# EAGLE design bandpass 40m v3 (EAGLE 9.1.2)
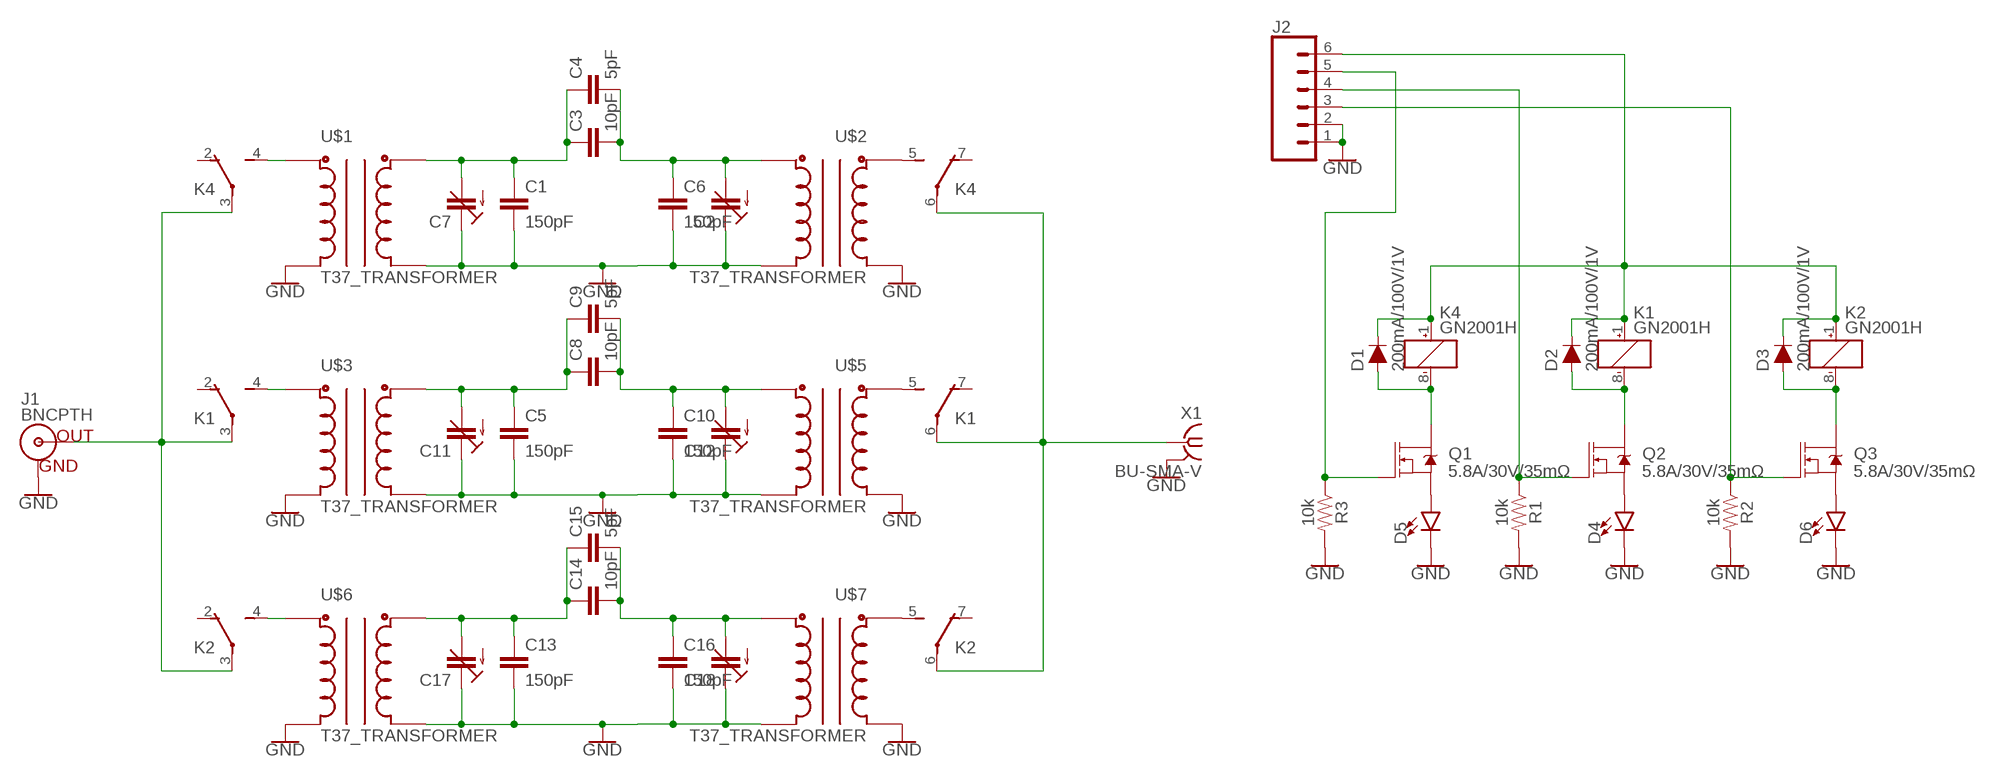
[diagram p0: schematic, sheet 1]

## Parts
C1  150pF  C5/3.5  [C5B3.5]
C2  C-TRIMMTZ03  [CTRIMTZ03]
C3  10pF  C5/3.5  [C5B3.5]
C4  5pF  C5/3.5  [C5B3.5]
C5  150pF  C5/3.5  [C5B3.5]
C6  150pF  C5/3.5  [C5B3.5]
C7  C-TRIMMTZ03  [CTRIMTZ03]
C8  10pF  C5/3.5  [C5B3.5]
C9  5pF  C5/3.5  [C5B3.5]
C10  150pF  C5/3.5  [C5B3.5]
C11  C-TRIMMTZ03  [CTRIMTZ03]
C12  C-TRIMMTZ03  [CTRIMTZ03]
C13  150pF  C5/3.5  [C5B3.5]
C14  10pF  C5/3.5  [C5B3.5]
C15  5pF  C5/3.5  [C5B3.5]
C16  150pF  C5/3.5  [C5B3.5]
C17  C-TRIMMTZ03  [CTRIMTZ03]
C18  C-TRIMMTZ03  [CTRIMTZ03]
D1  200mA/100V/1V  DIODE-1N4148  [DIODE-1N4148]
D2  200mA/100V/1V  DIODE-1N4148  [DIODE-1N4148]
D3  200mA/100V/1V  DIODE-1N4148  [DIODE-1N4148]
D4  LED5MM  [LED_5MM]
D5  LED5MM  [LED_5MM]
D6  LED5MM  [LED_5MM]
J1  BNCPTH  [BNC]
J2  CONN_06LONGPADS  [1X06_LONGPADS]
K1  GN2001H  [GN]
K2  GN2001H  [GN]
K4  GN2001H  [GN]
Q1  5.8A/30V/35mΩ  MOSFET-NCH-AO3404A  [SOT23-3]
Q2  5.8A/30V/35mΩ  MOSFET-NCH-AO3404A  [SOT23-3]
Q3  5.8A/30V/35mΩ  MOSFET-NCH-AO3404A  [SOT23-3]
R1  10k  1KOHM-HORIZ-1/4W-1%  [AXIAL-0.3]
R2  10k  1KOHM-HORIZ-1/4W-1%  [AXIAL-0.3]
R3  10k  1KOHM-HORIZ-1/4W-1%  [AXIAL-0.3]
U$1  T37_TRANSFORMER  [T37_TRANSFORMER]
U$2  T37_TRANSFORMER  [T37_TRANSFORMER]
U$3  T37_TRANSFORMER  [T37_TRANSFORMER]
U$5  T37_TRANSFORMER  [T37_TRANSFORMER]
U$6  T37_TRANSFORMER  [T37_TRANSFORMER]
U$7  T37_TRANSFORMER  [T37_TRANSFORMER]
X1  BU-SMA-V  [BU-SMA-V]

## Nets
GND: C1.2 C2.1(E) C5.2 C6.2 C7.1(E) C10.2 C11.1(E) C12.1(E) C13.2 C16.2 C17.1(E) C18.1(E) D4.K(C) D5.K(C) D6.K(C) J1.GND J2.1 J2.2 R1.P$2 R2.P$2 R3.P$2 U$1.C1A U$1.C2A U$2.C1A U$2.C2A U$3.C1A U$3.C2A U$5.C1A U$5.C2A U$6.C1A U$6.C2A U$7.C1A U$7.C2A X1.2 X1.3 X1.4 X1.5
N$1: C1.1 C3.1 C4.1 C7.2(A) U$1.C2B
N$2: K4.4(S:S) U$1.C1B
N$3: C2.2(A) C3.2 C4.2 C6.1 U$2.C2B
N$4: K1.6(T:P) K2.6(T:P) K4.6(T:P) X1.1
N$5: K4.5(T:S) U$2.C1B
N$6: C5.1 C8.1 C9.1 C11.2(A) U$3.C2B
N$7: C8.2 C9.2 C10.1 C12.2(A) U$5.C2B
N$8: K1.4(S:S) U$3.C1B
N$9: K1.5(T:S) U$5.C1B
N$10: C13.1 C14.1 C15.1 C17.2(A) U$6.C2B
N$11: C14.2 C15.2 C16.1 C18.2(A) U$7.C2B
N$12: J1.S(OUT) K1.3(S:P) K2.3(S:P) K4.3(S:P)
N$13: K2.5(T:S) U$7.C1B
N$14: K2.4(S:S) U$6.C1B
N$15: D1.A K4.8(R:-) Q1.3(D)
N$16: D2.A K1.8(R:-) Q2.3(D)
N$17: D3.A K2.8(R:-) Q3.3(D)
N$18: D4.A Q2.2(S)
N$19: J2.5 Q1.1(G) R3.P$1
N$20: J2.4 Q2.1(G) R1.P$1
N$21: J2.3 Q3.1(G) R2.P$1
N$22: D1.C D2.C D3.C J2.6 K1.1(R:+) K2.1(R:+) K4.1(R:+)
N$23: D5.A Q1.2(S)
N$24: D6.A Q3.2(S)
Unconnected: K1.2(S:O) K1.7(T:O) K2.2(S:O) K2.7(T:O) K4.2(S:O) K4.7(T:O)

## Library data of the parts
C1 C3-C6 C8-C10 C13-C16 = capacitor-wima:C: CAPACITOR naming: grid - package width
C2 C7 C11 C12 C17 C18 = resistor:C-TRIMM: Trimm capacitor
D1-D3 = SparkFun-DiscreteSemi:DIODE: Diode These are standard reverse protection diodes and small signal diodes. SparkFun Products: SparkFun SparkPunk Sound Kit <https://www.sparkfun.com/products/11177> SparkFun ESP8266 Thing <https://www.sparkfun.com/products/13231>; PROD_ID: DIO-08378
D4-D6 = SparkFun-LED:LED: LED (Generic) Standard schematic elements and footprints for 5mm, 3mm, 1206, and 0603 sized LEDs. Generic LEDs with no color specified.
J1 = SparkFun-Connectors:BNC: BNC Right Angle Connector Mouser Part# 5227161 SparkFun Products: BNC Connector - Right Angle <https://www.sparkfun.com/products/10550>; PROD_ID: LPA-12729; SF_ID: PRT-10550
J2 = SparkFun-Connectors:CONN_06: Multi connection point. Often used as Generic Header-pin footprint for 0.1 inch spaced/style header connections On any of the 0.1 inch spaced packages, you can populate with these: Break Away Headers - Straight <https://www.sparkfun.com/products/116> (PRT-00116) Break Away Male Headers - Right Angle <https://www.sparkfun.com/products/553> (PRT-00553) Female Headers <https://www.sparkfun.com/products/115> (PRT-00115) Break Away Headers - Machine Pin <https://www.sparkfun.com/products/117> (PRT-00117) Break Away Female Headers - Swiss Machine Pin <https://www.sparkfun.com/products/743> (PRT-00743) Arduino Stackable Header - 6 Pin <https://www.sparkfun.com/products/9280> (PRT-09280) For SCREWTERMINALS and SPRING TERMINALS visit here: Screw Terimnals on SparkFun.com <https://www.sparkfun.com/search/results?term=Screw+Terminals> (5mm/3.5mm/2.54mm spacing) This device is also useful as a general connection point to wire up your design to another part of your project. Our various solder wires solder well into these plated through hole pads. Hook-Up Wire - Assortment (Stranded, 22 AWG) <https://www.sparkfun.com/products/11375> (PRT-11375) Hook-Up Wire - Assortment (Solid Core, 22 AWG) <https://www.sparkfun.com/products/11367> (PRT-11367) View the entire wire category on our website here <https://www.sparkfun.com/categories/141>
K1 K2 K4 = relay:GN?*: ULTRA-SMALL PACKAGE SLIM POLARIZED RELAY NAiS Source: http://www.mew-europe.com/.. en_ds_61007_0000.pdf
Q1-Q3 = SparkFun-DiscreteSemi:MOSFET-NCH: N-channel MOSFETs Voltage controlled devices that allow control of high current outputs. SparkFun Products: SparkFun OpenScale <https://www.sparkfun.com/products/13261> SparkFun Digital Sandbox <https://www.sparkfun.com/products/12651> SparkFun Monster Moto Shield <https://www.sparkfun.com/products/10182> SparkFun MOSFET Power Controller <https://www.sparkfun.com/products/11214>; PROD_ID: TRANS-12988
R1-R3 = SparkFun-Resistors:1KOHM: 1kΩ resistor A resistor is a passive two-terminal electrical component that implements electrical resistance as a circuit element. Resistors act to reduce current flow, and, at the same time, act to lower voltage levels within circuits. - Wikipedia; PROD_ID: RES-12182; VALUE: 1k
U$1-U$3 U$5-U$7 = toroid:T37_TRANSFORMER: Transformer wound on a T37 Toroid
X1 = con-coax:BU-SMA-V: FEMALE SMA CONNECTOR Radiall distributor RS 112-3794; OC_FARNELL: unknown; OC_NEWARK: unknown

## Net classes
0 default: width 0.762 mm, drill 0.762 mm, clearance 0.508 mm

## Board
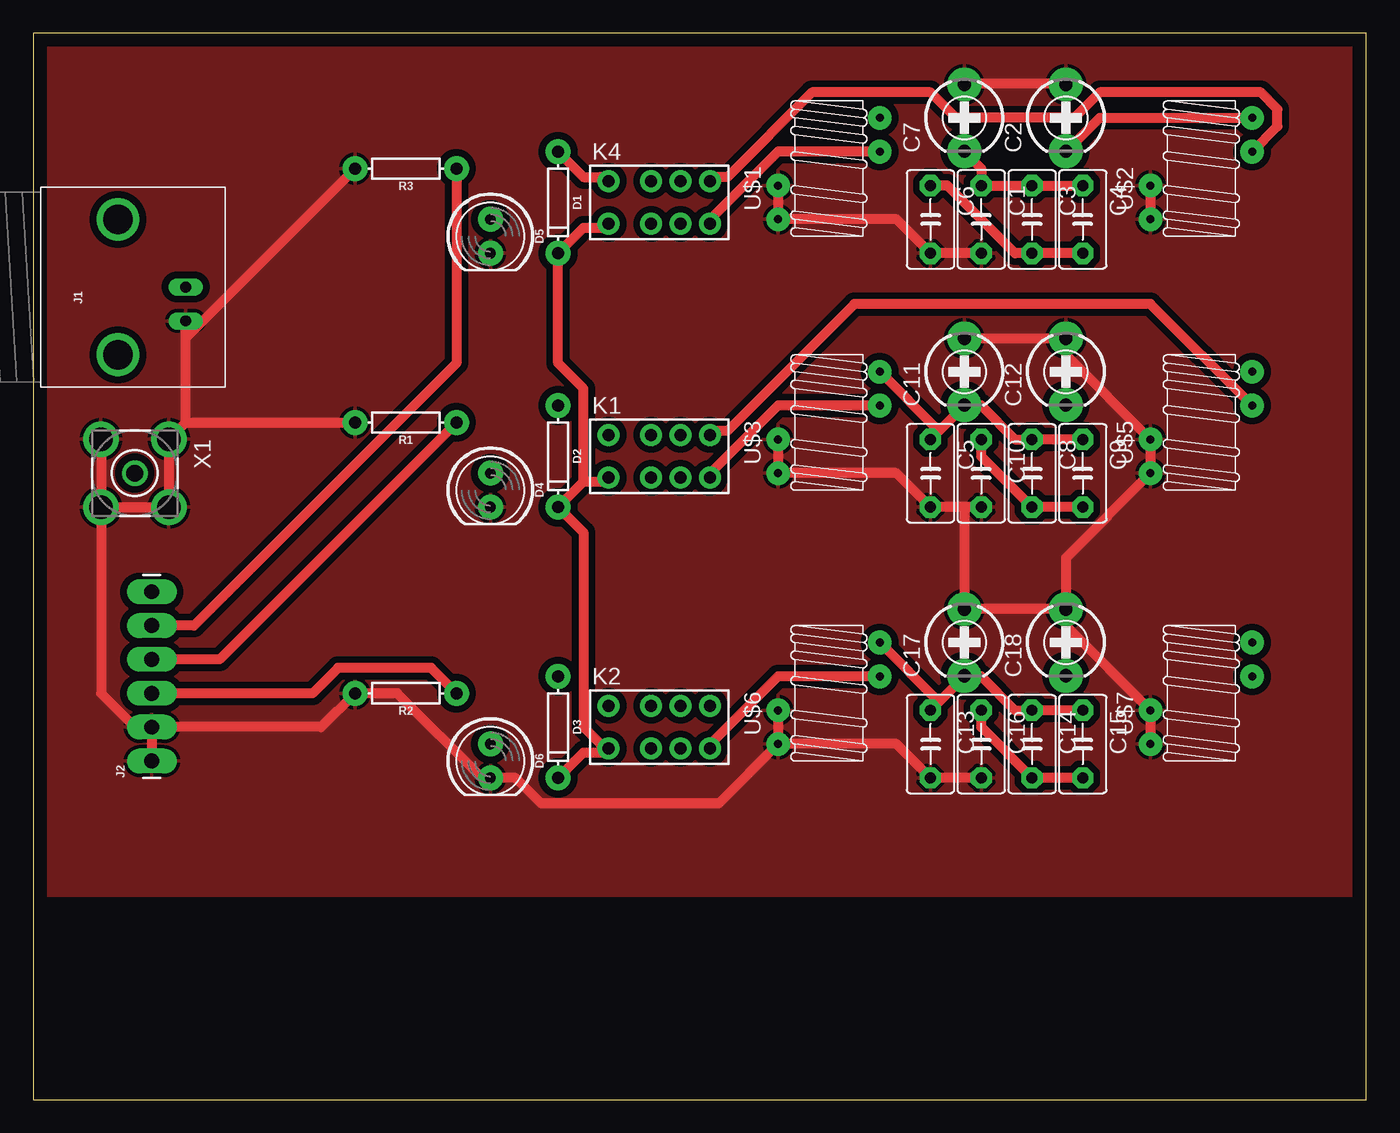
[diagram p1: board, top side]
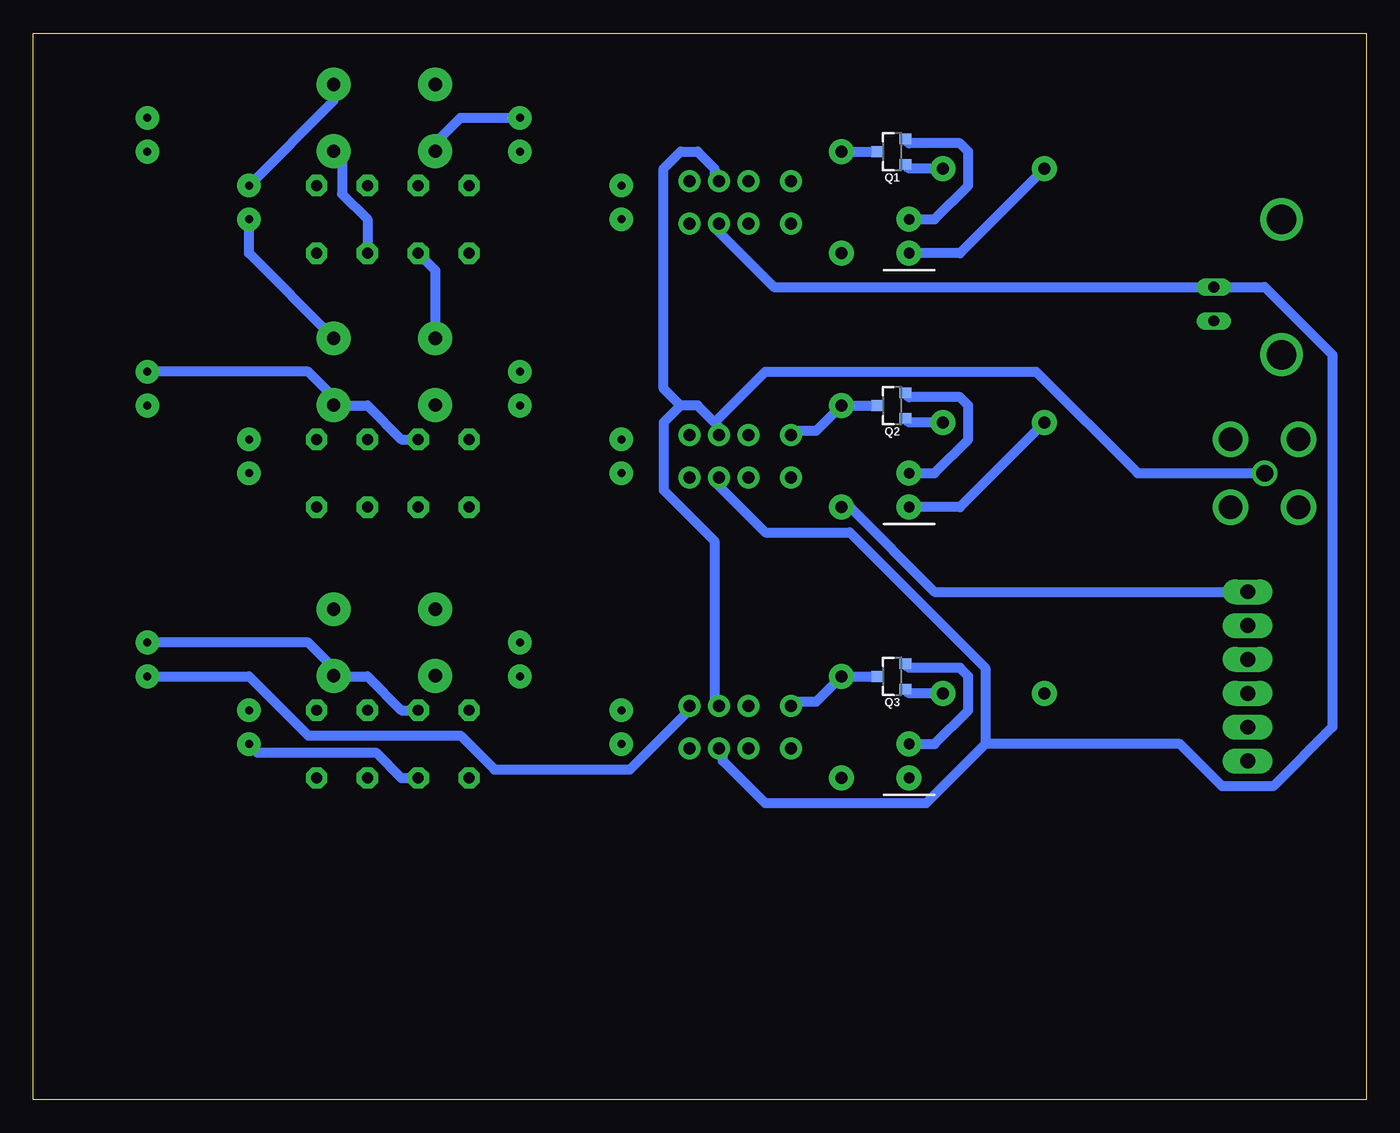
[diagram p2: board, bottom side, seen from below]

Size 100 x 80 mm. Coordinates in mm from the lower left corner, seen from the top.
Outline: 0,0 100,0 100,80 0,80 0,0
Copper layers (1*16): Top 0.035mm / dielectric 1.5mm / Bottom 0.035mm
Design rules "default": minimum track width 6mil, minimum drill 0.35mm, track to track 6mil, track to pad 6mil, pad to pad 6mil, via to via 6mil, smd to smd 6mil, copper to edge 40mil, drill to drill 6mil, minimum pad ring 10mil, minimum via ring 8mil, stop-mask expansion 4mil, vias tented up to drill 0mil, thermal gap 10mil

### Footprints (pad centres in the part's own frame; a part is rotated, then mirrored left to right if it is on the bottom)
C5B3.5 = drill 0.813 pad 1.6 octagon: 1 -2.54,0; 2 2.54,0
CTRIMTZ03 = drill 1 pad 2.54: 1 0,2.5; 2 0,-2.5
DIODE-1N4148 = drill 0.9 pad 1.88: A -3.81,0; C 3.81,0
LED_5MM = drill 0.813 pad 1.88: A -1.27,0; K 1.27,0
BNC = drill 2.2: 3 -5.08,5.08; 4 5.08,5.08 | drill 0.8 long: GND -2.54,0; S 0,0
1X06_LONGPADS = drill 1.118 pad 1.88 long: 1 0,0; 2 2.54,0; 3 5.08,0; 4 7.62,0; 5 10.16,0; 6 12.7,0
GN = drill 0.9 pad 1.651: 1 -3.835,-1.6; 2 -0.635,-1.6; 3 1.565,-1.6; 4 3.765,-1.6; 5 3.765,1.6; 6 1.565,1.6; 7 -0.635,1.6; 8 -3.835,1.6
SOT23-3 = smd 0.8 x 0.9: 1 -0.95,-1; 2 0.95,-1; 3 0,1.1
AXIAL-0.3 = drill 0.9 pad 1.88: P$1 -3.81,0; P$2 3.81,0
T37_TRANSFORMER = drill 0.6 pad 1.778: C1A -3.81,-3.81; C1B 3.81,1.27; C2A -3.81,-1.27; C2B 3.81,3.81
BU-SMA-V = drill 1.27: 1 0,0 | drill 1.778: 2 -2.55,2.55; 3 2.55,2.55; 4 2.55,-2.55; 5 -2.55,-2.55

### Placement (x,y rotation side)
C1  71.12,66.04 270 top
C2  77.47,73.66 0 top
C3  74.93,66.04 270 top
C4  78.74,66.04 270 top
C5  67.31,46.99 270 top
C6  67.31,66.04 270 top
C7  69.85,73.66 0 top
C8  74.93,46.99 270 top
C9  78.74,46.99 270 top
C10  71.12,46.99 270 top
C11  69.85,54.61 0 top
C12  77.47,54.61 0 top
C13  67.31,26.67 270 top
C14  74.93,26.67 270 top
C15  78.74,26.67 270 top
C16  71.12,26.67 270 top
C17  69.85,34.29 0 top
C18  77.47,34.29 0 top
D1  39.37,67.31 270 top
D2  39.37,48.26 270 top
D3  39.37,27.94 270 top
D4  34.29,45.72 270 top
D5  34.29,64.77 270 top
D6  34.29,25.4 270 top
J1  11.43,60.96 90 top
J2  8.89,25.4 90 top
K1  46.99,48.26 0 top
K2  46.99,27.94 0 top
K4  46.99,67.31 0 top
Q1  35.56,71.12 90 bottom
Q2  35.56,52.07 90 bottom
Q3  35.56,31.75 90 bottom
R1  27.94,50.8 180 top
R2  27.94,30.48 180 top
R3  27.94,69.85 180 top
U$1  59.69,69.85 0 top
U$2  87.63,69.85 0 top
U$3  59.69,50.8 0 top
U$5  87.63,50.8 0 top
U$6  59.69,30.48 0 top
U$7  87.63,30.48 0 top
X1  7.62,46.99 270 top

### Tracks (layer width: path | path; a pad name or v marks a point on that pad's centre or on a via)
GND
  Top 0.762: J2.2 J2.1 | J2.2 21.59,27.94 R2.P$2 27.3,30.48 33.66,24.13 D6.K 36.2,24.13 38.1,22.23 51.44,22.23 U$6.C1A | X1.4 X1.5 | X1.4 X1.3 | X1.4 5.08,43.81 5.08,30.48 7.62,27.94 J2.2 | 11.43,50.8 11.43,57.15 | 11.43,57.15 J1.GND | 11.43,50.8 X1.2 X1.3 | 11.43,50.8 R1.P$2 | X1.3 | 11.43,57.15 R3.P$2 | U$6.C2A U$6.C1A | C16.2 C13.2 64.77,26.67 U$6.C1A | U$7.C1A U$7.C2A 77.47,35.56 C18.1 77.47,36.83 | U$3.C2A U$3.C1A 64.77,46.99 C5.2 69.85,44.45 | C10.2 69.85,44.45 | 69.85,44.45 69.85,36.83 | 69.85,36.83 77.47,36.83 | 69.85,36.83 C17.1 | U$2.C2A U$2.C1A | C7.1 69.85,76.2 77.47,76.2 C2.1 | U$1.C2A U$1.C1A 64.77,66.04 C6.2 C1.2 | C11.1 69.85,57.15 77.47,57.15 C12.1 77.47,55.88 U$5.C2A U$5.C1A 77.47,40.64 77.47,36.83
  Bottom 0.762: D5.K 30.48,63.5 R3.P$2 | D4.K 30.48,44.45 R1.P$2 | C16.2 72.39,24.13 74.3,26.04 83.19,26.04 U$7.C1A | U$2.C2A 77.47,74.93 C2.1 | C11.1 69.85,62.23 C1.2 | U$2.C1A 83.82,63.5 77.47,57.15 C12.1
  pour Top: 0,80.01 100.33,80.01 100.33,15.24 0,15.24
N$1
  Top 0.762: C7.2 69.85,71.12 71.12,69.85 C1.1 C3.1 C4.1
  Bottom 0.762: U$1.C2B 67.94,73.66 69.85,71.75 C7.2
N$2
  Top 0.762: U$1.C1B 55.88,71.12 50.8,66.04 K4.4
N$3
  Top 0.762: C4.2 C3.2 73.66,63.5 68.58,68.58 C6.1 | U$2.C2B 80.01,73.66 77.47,71.12 C2.2
  Bottom 0.762: C3.2 74.93,66.04 76.83,67.94 76.83,70.48 77.47,71.12 C2.2
N$4
  Bottom 0.762: 51.44,52.07 52.7,50.8 52.7,45.72 48.9,41.91 48.9,29.84 K2.6 | 51.44,52.07 50.16,52.07 48.9,50.8 | 48.9,50.8 48.26,50.16 K1.6 | 51.44,52.07 52.7,53.34 52.7,69.85 51.44,71.12 50.16,71.12 48.9,69.85 48.9,69.22 K4.6 | X1.1 17.14,46.99 24.77,54.61 45.09,54.61 48.9,50.8
N$5
  Top 0.762: U$2.C1B 93.34,73.03 93.34,74.3 92.08,75.56 80.01,75.56 78.11,73.66 69.22,73.66 67.31,75.56 58.42,75.56 52.07,69.22 50.8,69.22 K4.5
N$6
  Top 0.762: C9.1 C8.1 73.66,49.53 71.12,52.07 69.85,52.07 | 69.85,52.07 67.94,50.16 | 67.94,50.16 C5.1 | 67.94,50.16 U$3.C2B | 69.85,52.07 C11.2
N$7
  Top 0.762: C9.2 C8.2 71.12,48.26 C10.1
  Bottom 0.762: U$5.C2B 79.38,54.61 77.47,52.7 C12.2 77.47,52.07 74.93,52.07 72.39,49.53 C10.1
N$8
  Top 0.762: U$3.C1B 55.88,52.07 50.8,46.99 K1.4
N$9
  Top 0.762: U$5.C1B 83.82,59.69 61.59,59.69 52.07,50.16 50.8,50.16 K1.5
N$10
  Top 0.762: C15.1 C14.1 73.66,29.21 71.12,31.75 69.85,31.75 | 69.85,31.75 67.94,29.84 | 67.94,29.84 C13.1 | 67.94,29.84 U$6.C2B | 69.85,31.75 C17.2
N$11
  Top 0.762: C15.2 C14.2 71.12,27.94 C16.1
  Bottom 0.762: U$7.C2B 79.38,34.29 77.47,32.38 C18.2 77.47,31.75 74.93,31.75 72.39,29.21 C16.1
N$12
  Bottom 0.762: 28.57,26.67 33.02,22.23 45.09,22.23 48.26,25.4 48.26,26.04 K2.3 | 28.57,26.67 28.57,32.38 38.73,42.55 45.09,42.55 48.9,46.35 K1.3 | K4.3 48.9,65.41 44.45,60.96 J1.S 7.62,60.96 2.54,55.88 2.54,27.94 6.99,23.5 10.79,23.5 13.97,26.67 28.57,26.67
N$13
  Bottom 0.762: U$7.C1B 83.82,31.75 79.38,27.3 67.94,27.3 65.41,24.77 55.24,24.77 50.8,29.21 K2.5
N$14
  Top 0.762: U$6.C1B 55.88,31.75 50.8,26.67 K2.4
N$15
  Top 0.762: D1.A 41.27,69.22 42.55,69.22 K4.8
  Bottom 0.762: D1.A Q1.3
N$16
  Bottom 0.762: Q2.3 D2.A 41.27,50.16 42.55,50.16 K1.8
N$17
  Bottom 0.762: Q3.3 D3.A 41.27,29.84 42.55,29.84 K2.8
N$18
  Bottom 0.762: D4.A 32.38,46.99 29.84,49.53 29.84,52.07 30.48,52.7 34.29,52.7 Q2.2
N$19
  Top 0.762: J2.5 12.06,35.56 31.75,55.24 R3.P$1
  Bottom 0.762: R3.P$1 34.29,69.85 Q1.1
N$20
  Top 0.762: J2.4 13.97,33.02 R1.P$1
  Bottom 0.762: R1.P$1 34.29,50.8 Q2.1
N$21
  Top 0.762: J2.3 20.95,30.48 22.86,32.38 29.84,32.38 R2.P$1
  Bottom 0.762: R2.P$1 34.29,30.48 Q3.1
N$22
  Top 0.762: K4.1 42.55,65.41 41.27,65.41 D1.C 39.37,55.24 41.27,53.34 41.27,46.35 | D3.C 41.27,26.04 42.55,26.04 K2.1 42.55,26.67 41.27,27.94 41.27,42.55 D2.C 41.27,46.35 | 41.27,46.35 42.55,46.35 K1.1
  Bottom 0.762: J2.6 32.38,38.1 38.73,44.45 D2.C
N$23
  Bottom 0.762: D5.A 32.38,66.04 29.84,68.58 29.84,71.12 30.48,71.75 34.29,71.75 Q1.2
N$24
  Bottom 0.762: D6.A 32.38,26.67 29.84,29.21 29.84,31.75 30.48,32.38 34.29,32.38 Q3.2